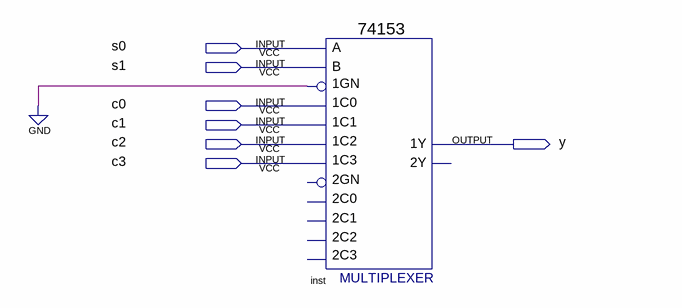
[diagram p0: schematic sheet]
// Quartus schematic xuan14.bdf as structural Verilog: 1 symbols, 7 pins
module xuan14 (
  input  s0,
  input  s1,
  input  c0,
  input  c1,
  input  c2,
  input  c3,
  output y
);

  \74153  inst (
    .\1C1 (c1), .\1GN (1'b0), .\1C0 (c0), .\1C2 (c2), .\1C3 (c3), .B(s1), .A(s0), .\1Y (y));  // open: 2C0, 2GN, 2C2, 2C1, 2C3, 2Y
endmodule
